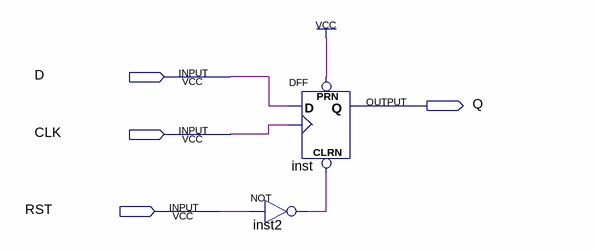
[diagram p0: schematic sheet]
// Quartus schematic mbr_dff.bdf as structural Verilog: 2 symbols, 4 pins
module mbr_dff (
  input  D,
  input  CLK,
  input  RST,
  output Q
);

  wire inst2_out;

  not inst2 (inst2_out, RST);
  DFF inst (.CLRN(inst2_out), .CLK(CLK), .D(D), .PRN(1'b1), .Q(Q));
endmodule
